# Altium schematic sheet CO_Potentiostat.SchDoc
size A4
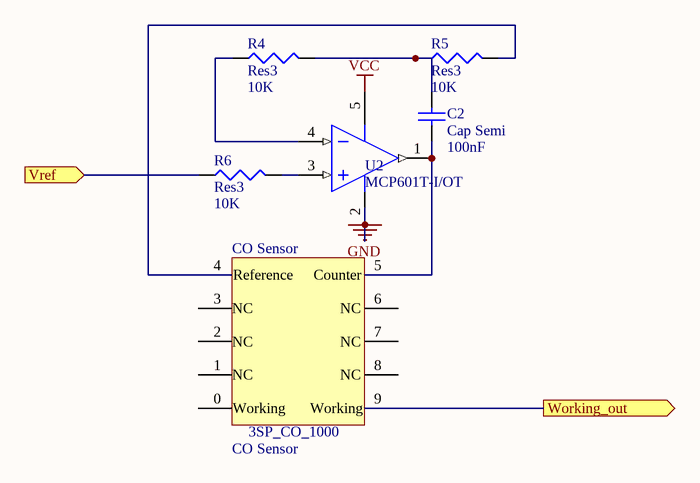
[diagram p0: CO_Potentiostat.SchDoc]

## Parts
C2  Cap Semi  value 100nF  [C1206]
CO_Sensor  CO Sensor  [Spec_Sensor]
R4  Res3  value 10K  [J1-0603]
R5  Res3  value 10K  [J1-0603]
R6  Res3  value 10K  [J1-0603]
U2  MCP601T-I/OT  [SOT-23-OT5_L]

## Ports
Vref (in), Working_out (out)

## Nets
GND: U2.2(VSS)
VCC: U2.5(VDD)
Vref: R6.1 ; port Vref
Working_out: CO_Sensor.9(Working) ; port Working_out
NetC2_1: C2.1 CO_Sensor.5(Counter) U2.1(VOUT)
NetC2_2: C2.2 R4.2 R5.1
NetCO_Sensor_4: CO_Sensor.4(Reference) R5.2
NetR4_1: R4.1 U2.4(VIN-)
NetR6_2: R6.2 U2.3(VIN+)

Not connected (* = marked no-connect by the designer): CO_Sensor 0(Working) 1(NC) 2(NC) 3(NC) 6(NC) 7(NC) 8(NC)

## Library data of the parts
C2 = Cap Semi: Capacitor (Semiconductor SIM Model); Published: 8-Jun-2000; LatestRevisionDate: 29-May-2009; LatestRevisionNote: IPC-7351 Footprint Added.; PackageReference: C1206; Publisher: Altium Limited; PackageDescription: Chip Capacitor
CO_Sensor = 3SP_CO_1000: 3SP_CO_1000 Package 110-109
R4-R6 = Res3: Resistor; Published: 8-Jun-2000; LatestRevisionDate: 29-May-2009; LatestRevisionNote: IPC-7351 Footprint Added.; PackageReference: J1-0603; Publisher: Altium Limited; PackageDescription: Chip Resistor
U2 = CMP-0187-00433-2: 2.7V to 6.0V Single Supply CMOS Operational Amplifier, 5-Pin SOT-23, Industrial Temperature, Tape and Reel; Code_IPC: SOT23-5; ComponentLink3Description: Package Specification; RevisionNote: URLs added.; PackageReference: SOT-23-OT5; ComponentLink3URL: http://www.microchip.com/stellent/groups/techpub_sg/documents/packagingspec/en012702.pdf; ComponentLink1Description: Manufacturer URL; DatasheetVersion: revG, Dec-2007; PackageDescription: 5-Lead Plastic Small Outline Transistor (OT) [SOT-23]; PackageVersion: revBB, Aug-2009; ComponentLink2Description: Datasheet; ComponentLink1URL: http://www.microchip.com/; ComponentLink2URL: http://ww1.microchip.com/downloads/en/DeviceDoc/21314g.pdf